# Altium schematic sheet Demux.SchDoc: QUTMS Shutdown V2 - Demux
size A3; Organization: QUT Motorsport; Address1: O-120; Address2: O Block; Address3: QUT Gardnes Point; Address4: Brisbane, 4000; DocumentNumber: 4; SheetNumber: 4; SheetTotal: 10
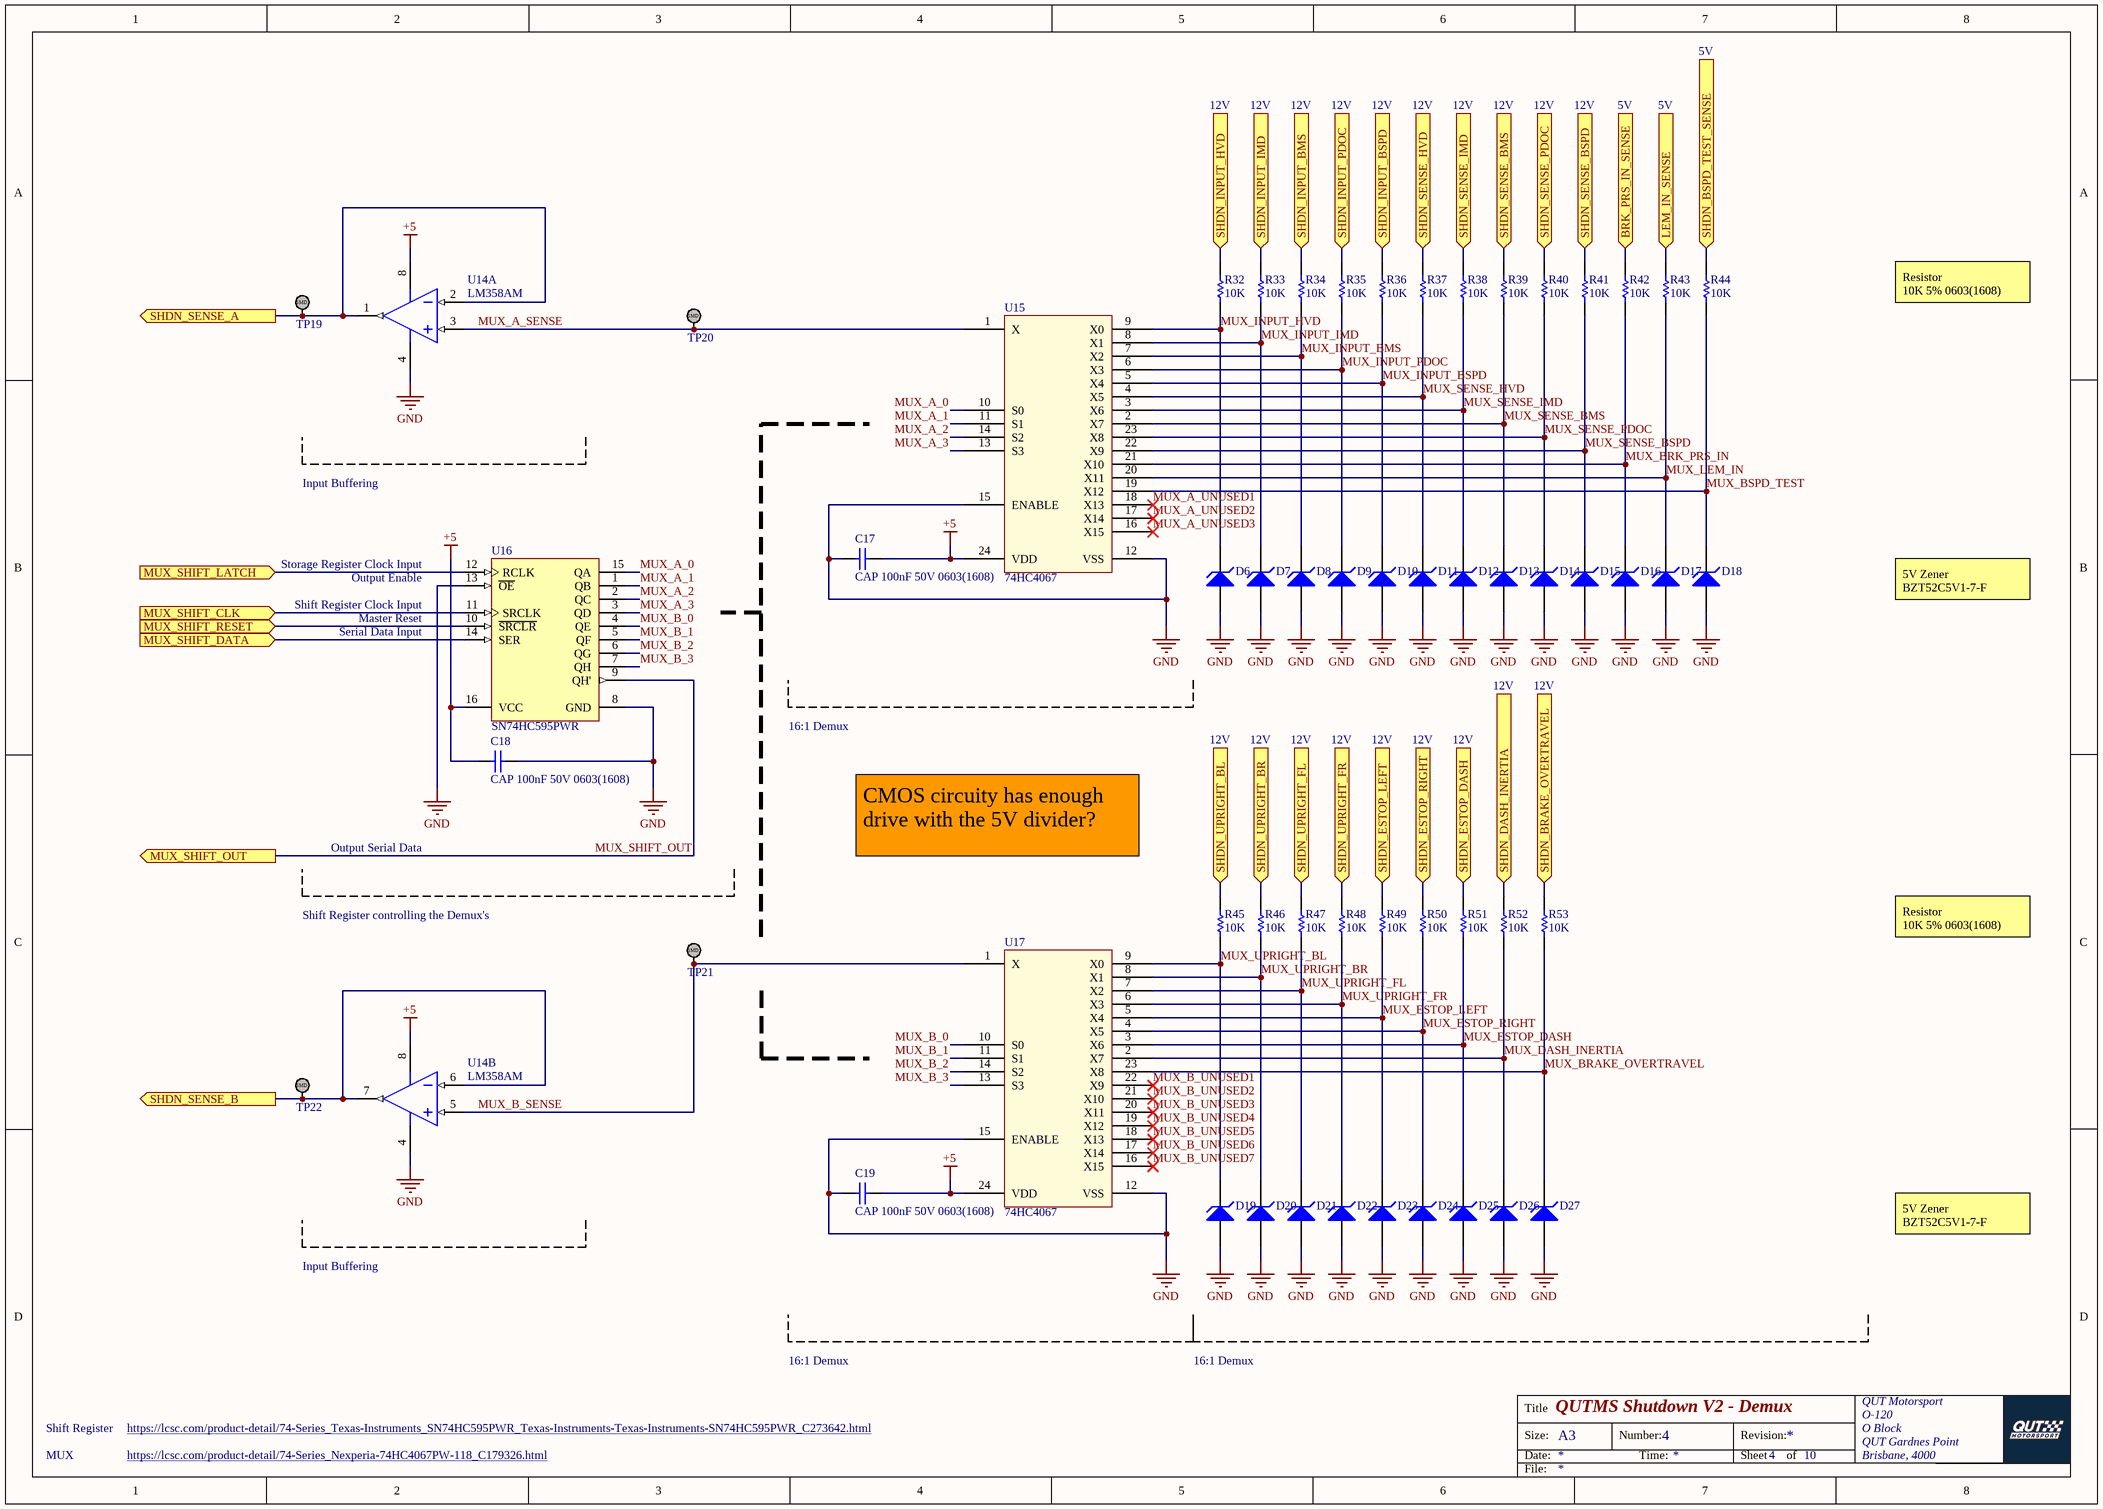
[diagram p0: Demux.SchDoc]

## Parts
C17  CAP 100nF 50V 0603(1608)  [CAPC0603(1608)100_L]
C18  CAP 100nF 50V 0603(1608)  [CAPC0603(1608)100_L]
C19  CAP 100nF 50V 0603(1608)  [CAPC0603(1608)100_L]
D6  BZT52C5V1-7-F  [DIOD-SOD123_V]  (value not drawn)
D7  BZT52C5V1-7-F  [DIOD-SOD123_V]  (value not drawn)
D8  BZT52C5V1-7-F  [DIOD-SOD123_V]  (value not drawn)
D9  BZT52C5V1-7-F  [DIOD-SOD123_V]  (value not drawn)
D10  BZT52C5V1-7-F  [DIOD-SOD123_V]  (value not drawn)
D11  BZT52C5V1-7-F  [DIOD-SOD123_V]  (value not drawn)
D12  BZT52C5V1-7-F  [DIOD-SOD123_V]  (value not drawn)
D13  BZT52C5V1-7-F  [DIOD-SOD123_V]  (value not drawn)
D14  BZT52C5V1-7-F  [DIOD-SOD123_V]  (value not drawn)
D15  BZT52C5V1-7-F  [DIOD-SOD123_V]  (value not drawn)
D16  BZT52C5V1-7-F  [DIOD-SOD123_V]  (value not drawn)
D17  BZT52C5V1-7-F  [DIOD-SOD123_V]  (value not drawn)
D18  BZT52C5V1-7-F  [DIOD-SOD123_V]  (value not drawn)
D19  BZT52C5V1-7-F  [DIOD-SOD123_V]  (value not drawn)
D20  BZT52C5V1-7-F  [DIOD-SOD123_V]  (value not drawn)
D21  BZT52C5V1-7-F  [DIOD-SOD123_V]  (value not drawn)
D22  BZT52C5V1-7-F  [DIOD-SOD123_V]  (value not drawn)
D23  BZT52C5V1-7-F  [DIOD-SOD123_V]  (value not drawn)
D24  BZT52C5V1-7-F  [DIOD-SOD123_V]  (value not drawn)
D25  BZT52C5V1-7-F  [DIOD-SOD123_V]  (value not drawn)
D26  BZT52C5V1-7-F  [DIOD-SOD123_V]  (value not drawn)
D27  BZT52C5V1-7-F  [DIOD-SOD123_V]  (value not drawn)
R32  10K  [RESC0603(1608)_N]
R33  10K  [RESC0603(1608)_N]
R34  10K  [RESC0603(1608)_N]
R35  10K  [RESC0603(1608)_N]
R36  10K  [RESC0603(1608)_N]
R37  10K  [RESC0603(1608)_N]
R38  10K  [RESC0603(1608)_N]
R39  10K  [RESC0603(1608)_N]
R40  10K  [RESC0603(1608)_N]
R41  10K  [RESC0603(1608)_N]
R42  10K  [RESC0603(1608)_N]
R43  10K  [RESC0603(1608)_N]
R44  10K  [RESC0603(1608)_N]
R45  10K  [RESC0603(1608)_N]
R46  10K  [RESC0603(1608)_N]
R47  10K  [RESC0603(1608)_N]
R48  10K  [RESC0603(1608)_N]
R49  10K  [RESC0603(1608)_N]
R50  10K  [RESC0603(1608)_N]
R51  10K  [RESC0603(1608)_N]
R52  10K  [RESC0603(1608)_N]
R53  10K  [RESC0603(1608)_N]
TP19  TestPoint_SMD  [TestPointSMD]  (value not drawn)
TP20  TestPoint_SMD  [TestPointSMD]  (value not drawn)
TP21  TestPoint_SMD  [TestPointSMD]  (value not drawn)
TP22  TestPoint_SMD  [TestPointSMD]  (value not drawn)
U14  LM358AM  [D0008A_M]  (parts A,B of 2)
U15  74HC4067  [74HC4067 TSSOP24]
U16  SN74HC595PWR  [PW0016A_L]
U17  74HC4067  [74HC4067 TSSOP24]

## Ports
BRK_PRS_IN_SENSE (in), LEM_IN_SENSE (in), MUX_SHIFT_CLK (in), MUX_SHIFT_DATA (in), MUX_SHIFT_LATCH (in), MUX_SHIFT_OUT (out), MUX_SHIFT_RESET (in), SHDN_BRAKE_OVERTRAVEL (in), SHDN_BSPD_TEST_SENSE (in), SHDN_DASH_INERTIA (in), SHDN_ESTOP_DASH (in), SHDN_ESTOP_LEFT (in), SHDN_ESTOP_RIGHT (in), SHDN_INPUT_BMS (in), SHDN_INPUT_BSPD (in), SHDN_INPUT_HVD (in), SHDN_INPUT_IMD (in), SHDN_INPUT_PDOC (in), SHDN_SENSE_A (out), SHDN_SENSE_B (out), SHDN_SENSE_BMS (in), SHDN_SENSE_BSPD (in), SHDN_SENSE_HVD (in), SHDN_SENSE_IMD (in), SHDN_SENSE_PDOC (in), SHDN_UPRIGHT_BL (in), SHDN_UPRIGHT_BR (in), SHDN_UPRIGHT_FL (in), SHDN_UPRIGHT_FR (in)

## Nets
+5: C17.1 C18.2 C19.1 U14.8(V+) U15.24(VDD) U16.16(VCC) U17.24(VDD)
GND: C17.2 C18.1 C19.2 D6.1(A) D7.1(A) D8.1(A) D9.1(A) D10.1(A) D11.1(A) D12.1(A) D13.1(A) D14.1(A) D15.1(A) D16.1(A) D17.1(A) D18.1(A) D19.1(A) D20.1(A) D21.1(A) D22.1(A) D23.1(A) D24.1(A) D25.1(A) D26.1(A) D27.1(A) U14.4(GND) U15.12(VSS) U15.15(ENABLE) U16.8(GND) U16.13(~{OE}) U17.12(VSS) U17.15(ENABLE)
BRK_PRS_IN_SENSE: R42.1 ; port BRK_PRS_IN_SENSE
LEM_IN_SENSE: R43.1 ; port LEM_IN_SENSE
MUX_A_0: U15.10(S0) U16.15(QA)
MUX_A_1: U15.11(S1) U16.1(QB)
MUX_A_2: U15.14(S2) U16.2(QC)
MUX_A_3: U15.13(S3) U16.3(QD)
MUX_A_SENSE: TP20.1 U14.3(INA+) U15.1(X)
MUX_A_UNUSED1: U15.18(X13)
MUX_A_UNUSED2: U15.17(X14)
MUX_A_UNUSED3: U15.16(X15)
MUX_B_0: U16.4(QE) U17.10(S0)
MUX_B_1: U16.5(QF) U17.11(S1)
MUX_B_2: U16.6(QG) U17.14(S2)
MUX_B_3: U16.7(QH) U17.13(S3)
MUX_B_SENSE: TP21.1 U14.5(INB+) U17.1(X)
MUX_B_UNUSED1: U17.22(X9)
MUX_B_UNUSED2: U17.21(X10)
MUX_B_UNUSED3: U17.20(X11)
MUX_B_UNUSED4: U17.19(X12)
MUX_B_UNUSED5: U17.18(X13)
MUX_B_UNUSED6: U17.17(X14)
MUX_B_UNUSED7: U17.16(X15)
MUX_BRAKE_OVERTRAVEL: D27.2(K) R53.2 U17.23(X8)
MUX_BRK_PRS_IN: D16.2(K) R42.2 U15.21(X10)
MUX_BSPD_TEST: D18.2(K) R44.2 U15.19(X12)
MUX_DASH_INERTIA: D26.2(K) R52.2 U17.2(X7)
MUX_ESTOP_DASH: D25.2(K) R51.2 U17.3(X6)
MUX_ESTOP_LEFT: D23.2(K) R49.2 U17.5(X4)
MUX_ESTOP_RIGHT: D24.2(K) R50.2 U17.4(X5)
MUX_INPUT_BMS: D8.2(K) R34.2 U15.7(X2)
MUX_INPUT_BSPD: D10.2(K) R36.2 U15.5(X4)
MUX_INPUT_HVD: D6.2(K) R32.2 U15.9(X0)
MUX_INPUT_IMD: D7.2(K) R33.2 U15.8(X1)
MUX_INPUT_PDOC: D9.2(K) R35.2 U15.6(X3)
MUX_LEM_IN: D17.2(K) R43.2 U15.20(X11)
MUX_SENSE_BMS: D13.2(K) R39.2 U15.2(X7)
MUX_SENSE_BSPD: D15.2(K) R41.2 U15.22(X9)
MUX_SENSE_HVD: D11.2(K) R37.2 U15.4(X5)
MUX_SENSE_IMD: D12.2(K) R38.2 U15.3(X6)
MUX_SENSE_PDOC: D14.2(K) R40.2 U15.23(X8)
MUX_SHIFT_CLK: U16.11(SRCLK) ; port MUX_SHIFT_CLK
MUX_SHIFT_DATA: U16.14(SER) ; port MUX_SHIFT_DATA
MUX_SHIFT_LATCH: U16.12(RCLK) ; port MUX_SHIFT_LATCH
MUX_SHIFT_OUT: U16.9(QH') ; port MUX_SHIFT_OUT
MUX_SHIFT_RESET: U16.10(~{SRCLR}) ; port MUX_SHIFT_RESET
MUX_UPRIGHT_BL: D19.2(K) R45.2 U17.9(X0)
MUX_UPRIGHT_BR: D20.2(K) R46.2 U17.8(X1)
MUX_UPRIGHT_FL: D21.2(K) R47.2 U17.7(X2)
MUX_UPRIGHT_FR: D22.2(K) R48.2 U17.6(X3)
SHDN_BRAKE_OVERTRAVEL: R53.1 ; port SHDN_BRAKE_OVERTRAVEL
SHDN_BSPD_TEST_SENSE: R44.1 ; port SHDN_BSPD_TEST_SENSE
SHDN_DASH_INERTIA: R52.1 ; port SHDN_DASH_INERTIA
SHDN_ESTOP_DASH: R51.1 ; port SHDN_ESTOP_DASH
SHDN_ESTOP_LEFT: R49.1 ; port SHDN_ESTOP_LEFT
SHDN_ESTOP_RIGHT: R50.1 ; port SHDN_ESTOP_RIGHT
SHDN_INPUT_BMS: R34.1 ; port SHDN_INPUT_BMS
SHDN_INPUT_BSPD: R36.1 ; port SHDN_INPUT_BSPD
SHDN_INPUT_HVD: R32.1 ; port SHDN_INPUT_HVD
SHDN_INPUT_IMD: R33.1 ; port SHDN_INPUT_IMD
SHDN_INPUT_PDOC: R35.1 ; port SHDN_INPUT_PDOC
SHDN_SENSE_A: TP19.1 U14.1(OUTA) U14.2(INA-) ; port SHDN_SENSE_A
SHDN_SENSE_B: TP22.1 U14.6(INB-) U14.7(OUTB) ; port SHDN_SENSE_B
SHDN_SENSE_BMS: R39.1 ; port SHDN_SENSE_BMS
SHDN_SENSE_BSPD: R41.1 ; port SHDN_SENSE_BSPD
SHDN_SENSE_HVD: R37.1 ; port SHDN_SENSE_HVD
SHDN_SENSE_IMD: R38.1 ; port SHDN_SENSE_IMD
SHDN_SENSE_PDOC: R40.1 ; port SHDN_SENSE_PDOC
SHDN_UPRIGHT_BL: R45.1 ; port SHDN_UPRIGHT_BL
SHDN_UPRIGHT_BR: R46.1 ; port SHDN_UPRIGHT_BR
SHDN_UPRIGHT_FL: R47.1 ; port SHDN_UPRIGHT_FL
SHDN_UPRIGHT_FR: R48.1 ; port SHDN_UPRIGHT_FR

## Notes on the sheet
- 12V
- 5V
- Resistor
  10K 5% 0603(1608)
- Input Buffering
- Output Enable
- Storage Register Clock Input
- Serial Data Input
- Master Reset
- Shift Register Clock Input
- 5V Zener
  BZT52C5V1-7-F
- 16:1 Demux
- Output Serial Data
- CMOS circuity has enough drive with the 5V divider?
- Shift Register controlling the Demux's
- MUX
- Shift Register
- https://lcsc.com/product-detail/74-Series_Nexperia-74HC4067PW-118_C179326.html
- https://lcsc.com/product-detail/74-Series_Texas-Instruments_SN74HC595PWR_Texas-Instruments-Texas-Instruments-SN74HC595PWR_C273642.html
- Title
- Size:
- Date:
- A3
- Number:
- Time:
- Revision:
- Sheet
- of
- File:
- (in symbol TestPoint_SMD) SMD

## Library data of the parts
C17-C19 = CMP-1035-02591-1: CAP 100nF 50V ±5% 0603 (1608 Metric) Thickness 1mm SMD; Tolerance: Â±5%; Case-Metric: 1608; Case-EIA: 0603; Rated Voltage: 50 V; Max Thickness: 1 mm; Technology: SMT; Value: 100nF
D6-D27 = CMP-2000-05976-1: Surface Mount Zener Diode, 5.1 V, -65 to 150 degC, 2-Pin SMD (SOD-123), RoHS, Tape and Reel; Manufacturer: DiodesIncorporated; Unit Weight: 0.000353oz; Zz - Zener Impedance: 60Ohms; Vz - Zener Voltage: 5.1V; Pd - Power Dissipation: 500mW; Zener Current: 5mA; Ir - Reverse Current: 2uA; Voltage Temperature Coefficient: -0.75mV/C; Configuration: Single; Voltage Tolerance: 6%; Height: 1.35mm; Width: 1.7mm; Minimum Operating Temperature: -65C; Series: BZT52C5; Package Description: 2-Pin Surface Mount Device, Body 2.7 x 1.55 mm; Length: 2.85mm; Mounting Technology: SurfaceMount; Brand: DiodesIncorporated; Factory Pack Quantity: 3000; Product Category: ZenerDiodes; RoHS: True; Manufacturer URL: http://www.diodes.com/; Termination Style: SMD/SMT; Package / Case: SOD-123; Packaging: Reel; Package Reference: SOD123; Datasheet Version: Rev. 37-2, 09/2012; Maximum Operating Temperature: +150C; Datasheet URL: http://www.diodes.com/_files/datasheets/ds18004.pdf; Mounting Style: SMD/SMT
R32-R53 = CMP-1012-00098-1: 10K 0.1W 5% 0603 (1608 Metric)  SMD; Case-EIA: 0603; Value: 10000.00 Ohm; Case-Metric: 1608; Technology: SMT; Tolerance: 5 %; Power: 0.1 W
U14 = CMP-0055-00796-3: Low Power Dual Operational Amplifier, 8-pin Narrow SOIC; Manufacturer: Texas Instruments; CompType: Amplifiers; PackageTopMarking: NSZXTT*LM*358AM; PowerWise: N; Code_JEDEC: MS-012-AA; RoHS: N; PinCount: 8; Package Reference: D0008A; ComponentLink1Description: Datasheet URL; ComponentLink1URL: http://www.ti.com/general/docs/lit/getliterature.tsp?genericPartNumber=LM358-N&fileType=pdf; Code_IPC: SOIC127P600-8; PackageDescription: SOIC Narrow, 4.9 x 3.9 x 1.45mm, 8 Lead, 1.27mm Pitch
U16 = CMP-0780-00192-3: 8-Bit Shift Registers With 3-State Output Registers, PW0016A, LARGE T&R; Manufacturer: Texas Instruments; VCC(Max)(V): 6; Bits: 8; Output Type: CMOS; 3-State Output: Yes; Output Drive (IOL/IOH)(Max)(mA): 7.8/-7.8; VCC(Min)(V): 2; Rating: Military; tpd @ Nom Voltage(Max)(ns): 34; ICC @ Nom Voltage(Max)(mA): 0.08; Technology Family: HC; F @ Nom Voltage(Max)(Mhz): 28; PackageReference: PW0016A; Generic Part Number: SN74HC595; Operating Temperature Range(C): -40 to 85; PackageVersion: http://www.ti.com/lit/ml/mpds361/mpds361.pdf; Code_JEDEC: MO-153; DatasheetVersion: SCLS041H; Voltage(Nom)(V): 6; Input Type: CMOS